# EAGLE design sense_part (EAGLE 7.2.0)
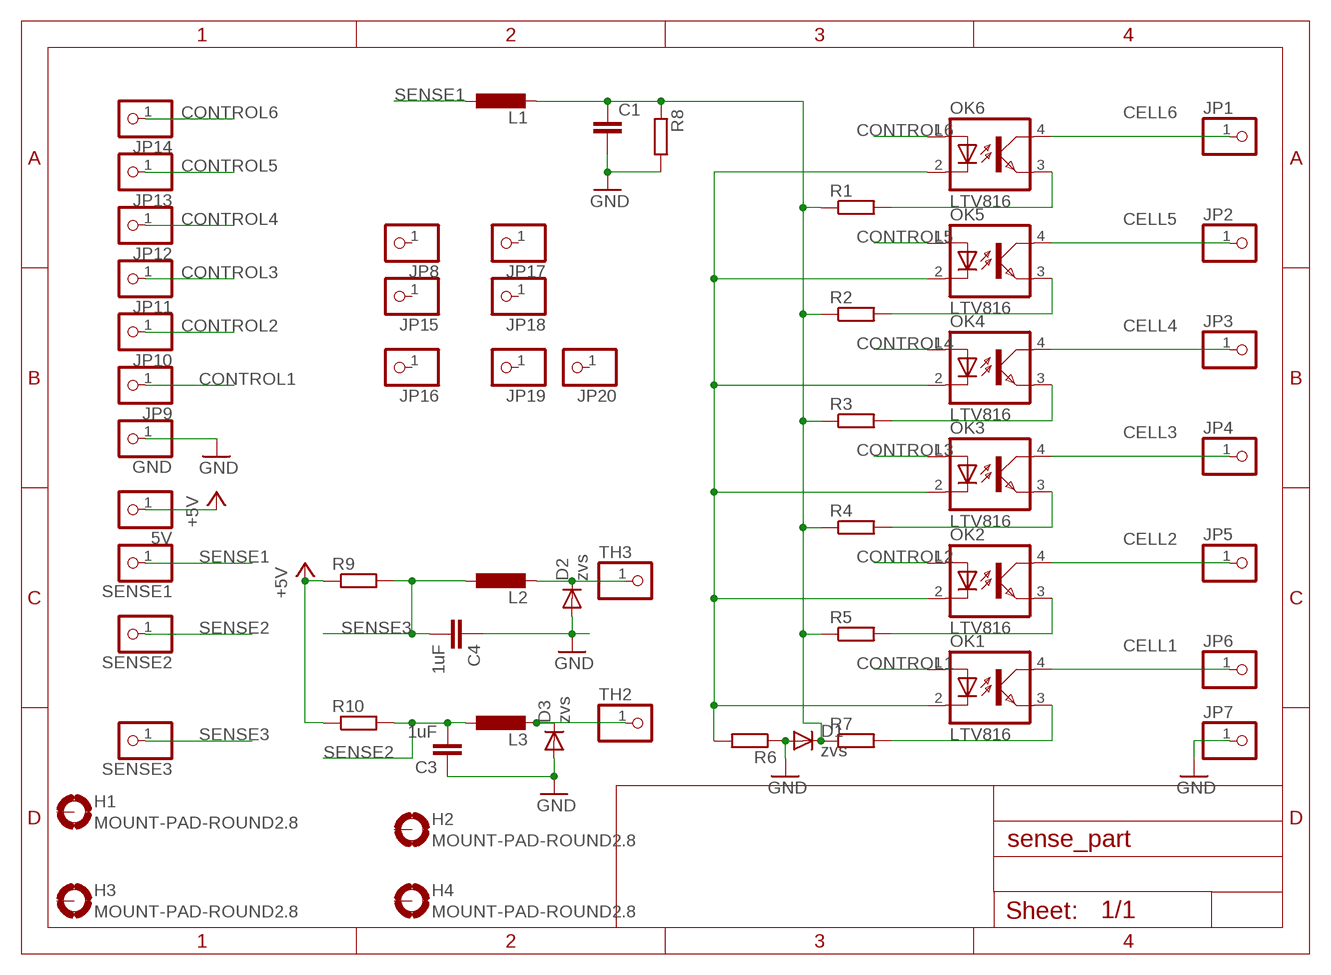
[diagram p0: schematic, sheet 1]

## Parts
5V  PINHD-1X1  [1X01]
C1  C-EU050-030X075  [C050-030X075]
C3  1uF  C-EU025-024X044  [C025-024X044]
C4  1uF  C-EU025-024X044  [C025-024X044]
D1  zvs  CGRM4001-G  [SOD-123_MINI-SMA]
D2  zvs  CGRM4001-G  [SOD-123_MINI-SMA]
D3  zvs  CGRM4001-G  [SOD-123_MINI-SMA]
GND  PINHD-1X1  [1X01]
H1  MOUNT-PAD-ROUND2.8  [2,8-PAD]
H2  MOUNT-PAD-ROUND2.8  [2,8-PAD]
H3  MOUNT-PAD-ROUND2.8  [2,8-PAD]
H4  MOUNT-PAD-ROUND2.8  [2,8-PAD]
JP1  PINHD-1X1  [1X01]
JP2  PINHD-1X1  [1X01]
JP3  PINHD-1X1  [1X01]
JP4  PINHD-1X1  [1X01]
JP5  PINHD-1X1  [1X01]
JP6  PINHD-1X1  [1X01]
JP7  PINHD-1X1  [1X01]
JP8  PINHD-1X1  [1X01]
JP9  PINHD-1X1  [1X01]
JP10  PINHD-1X1  [1X01]
JP11  PINHD-1X1  [1X01]
JP12  PINHD-1X1  [1X01]
JP13  PINHD-1X1  [1X01]
JP14  PINHD-1X1  [1X01]
JP15  PINHD-1X1  [1X01]
JP16  PINHD-1X1  [1X01]
JP17  PINHD-1X1  [1X01]
JP18  PINHD-1X1  [1X01]
JP19  PINHD-1X1  [1X01]
JP20  PINHD-1X1  [1X01]
L1  L-EU0207/12  [0207/12]
L2  L-EU0207/12  [0207/12]
L3  L-EU0207/12  [0207/12]
OK1  LTV816  [DIL04]
OK2  LTV816  [DIL04]
OK3  LTV816  [DIL04]
OK4  LTV816  [DIL04]
OK5  LTV816  [DIL04]
OK6  LTV816  [DIL04]
R1  R-EU_R1206  [R1206]
R2  R-EU_R1206  [R1206]
R3  R-EU_R1206  [R1206]
R4  R-EU_R1206  [R1206]
R5  R-EU_R1206  [R1206]
R6  R-EU_R1206  [R1206]
R7  R-EU_R1206  [R1206]
R8  R-EU_R1206  [R1206]
R9  R-EU_R1206  [R1206]
R10  R-EU_R1206  [R1206]
SENSE1  PINHD-1X1  [1X01]
SENSE2  PINHD-1X1  [1X01]
SENSE3  PINHD-1X1  [1X01]
TH2  PINHD-1X1  [1X01]
TH3  PINHD-1X1  [1X01]

## Nets
+5V: 5V.1 R9.1 R10.1
CELL1: JP6.1 OK1.4(COL)
CELL2: JP5.1 OK2.4(COL)
CELL3: JP4.1 OK3.4(COL)
CELL4: JP3.1 OK4.4(COL)
CELL5: JP2.1 OK5.4(COL)
CELL6: JP1.1 OK6.4(COL)
CONTROL1: JP9.1 OK1.1(A)
CONTROL2: JP10.1 OK2.1(A)
CONTROL3: JP11.1 OK3.1(A)
CONTROL4: JP12.1 OK4.1(A)
CONTROL5: JP13.1 OK5.1(A)
CONTROL6: JP14.1 OK6.1(A)
GND: C1.2 C3.1 C4.1 D1.A D2.A D3.A GND.1 JP7.1 R6.1 R8.2
N$1: OK1.2(C) OK2.2(C) OK3.2(C) OK4.2(C) OK5.2(C) OK6.2(C) R6.2
N$2: OK2.3(EMIT) R5.2
N$3: OK3.3(EMIT) R4.2
N$4: OK4.3(EMIT) R3.2
N$5: OK5.3(EMIT) R2.2
N$6: OK6.3(EMIT) R1.2
N$7: D3.C L3.2 TH2.1
N$8: OK1.3(EMIT) R7.2
N$9: C1.1 D1.C L1.2 R1.1 R2.1 R3.1 R4.1 R5.1 R7.1 R8.1
N$12: D2.C L2.2 TH3.1
SENSE1: L1.1 SENSE1.1
SENSE2: C3.2 L3.1 R10.2 SENSE2.1
SENSE3: C4.2 L2.1 R9.2 SENSE3.1
Unconnected: H1.B2,8(MOUNT) H2.B2,8(MOUNT) H3.B2,8(MOUNT) H4.B2,8(MOUNT) JP8.1 JP15.1 JP16.1 JP17.1 JP18.1 JP19.1 JP20.1

## Library data of the parts
5V GND JP1-JP20 SENSE1-SENSE3 TH2 TH3 = pinhead:PINHD-1X1: PIN HEADER
C1 = rcl:C-EU: CAPACITOR, European symbol
C3 C4 = resistor:C-EU: CAPACITOR, European symbol
D1-D3 = diode:CGRM400*-G: Molded plasitc,JEDEC SOD-123/Mini SMA Source: Comchip CGRM4001-G.pdf
H1-H4 = holes:MOUNT-PAD-ROUND: MOUNTING PAD, round
L1-L3 = rcl:L-EU: INDUCTOR, European symbol
OK1-OK6 = optocoupler:LTV816: OPTO COUPLER Source: LITEON, LTV816.pdf; OC_FARNELL: unknown; OC_NEWARK: unknown
R1-R10 = rcl:R-EU_: RESISTOR, European symbol

## Board
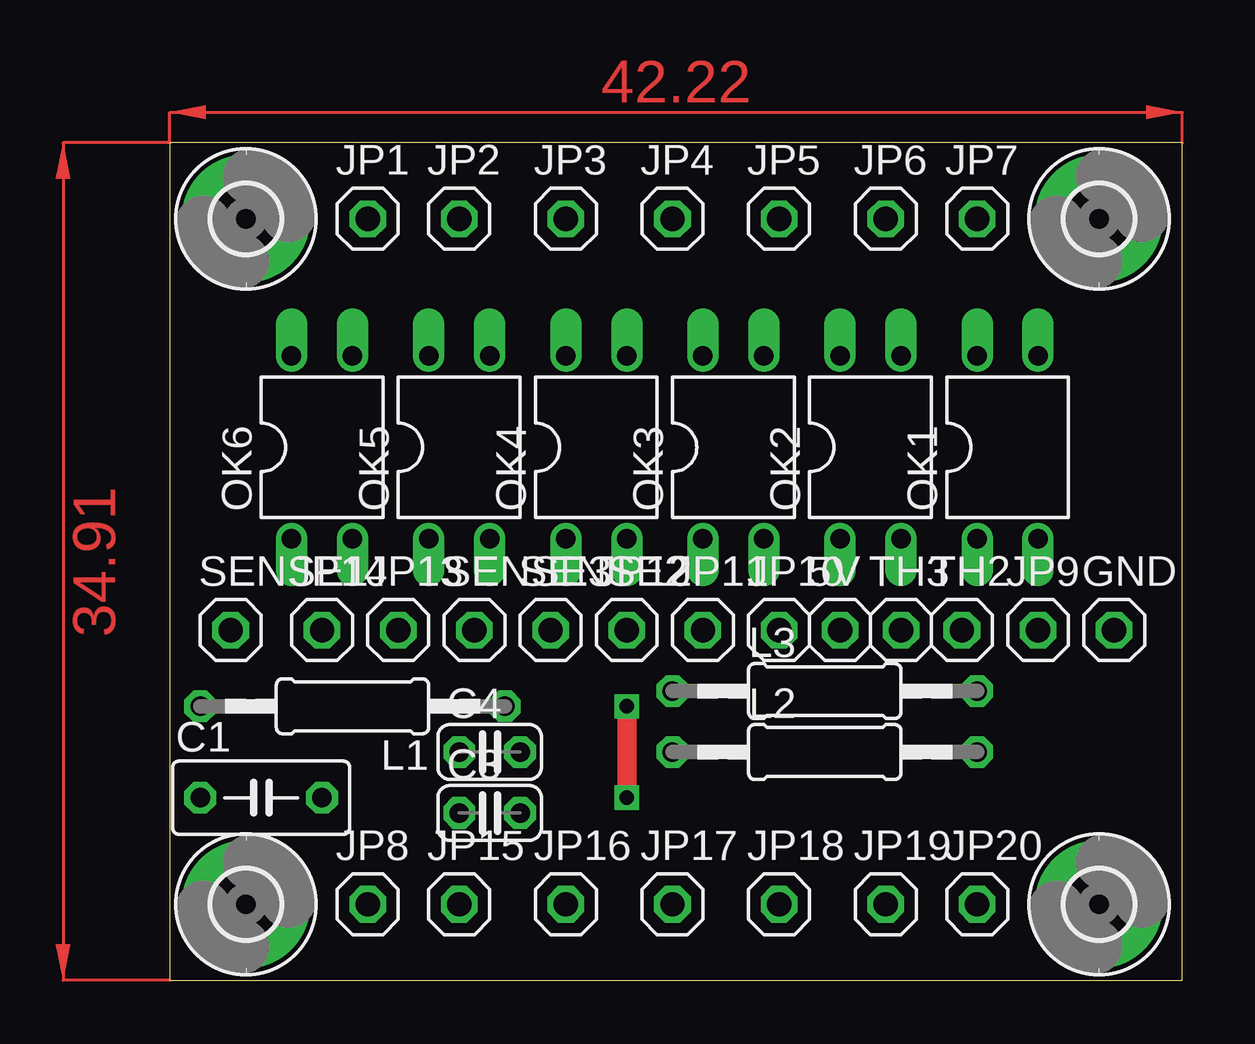
[diagram p1: board, top side]
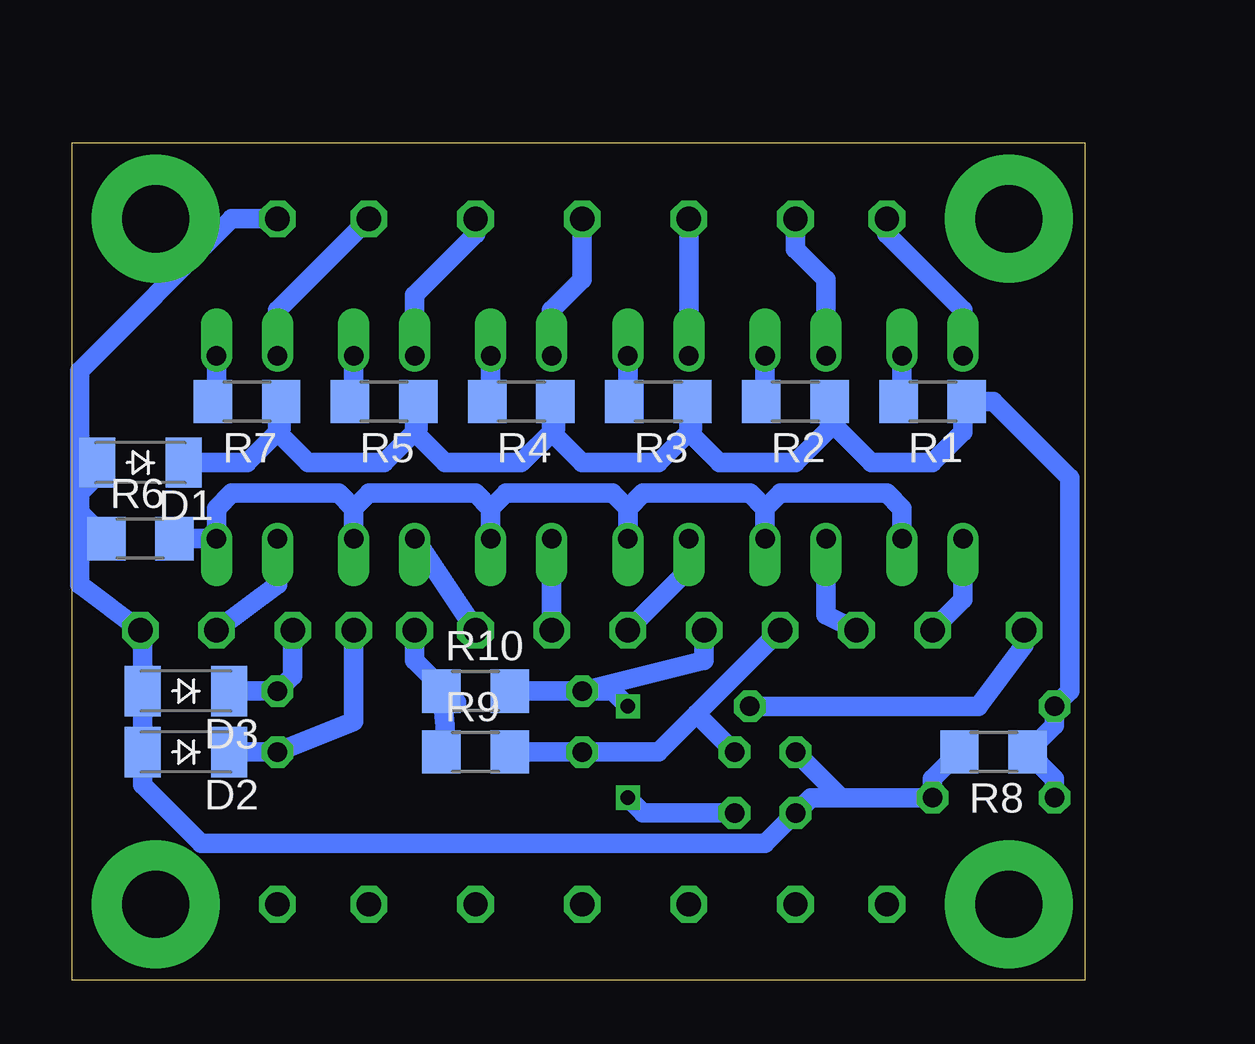
[diagram p2: board, bottom side, seen from below]

Size 42.22 x 34.91 mm. Coordinates in mm from the lower left corner, seen from the top.
Outline: 0,0 42.22,0 42.22,34.91 0,34.91 0,0
Copper layers (1*16): Top 0.035mm / dielectric 1.5mm / Bottom 0.035mm
Design rules "default": minimum track width 10mil, minimum drill 24mil, track to track 8mil, track to pad 8mil, pad to pad 8mil, via to via 8mil, smd to smd 8mil, copper to edge 40mil, drill to drill 8mil, minimum pad ring 10mil, minimum via ring 8mil, stop-mask expansion 4mil, vias tented up to drill 0mil, thermal gap 10mil

### Footprints (pad centres in the part's own frame; a part is rotated, then mirrored left to right if it is on the bottom)
1X01 = drill 1.016 octagon: 1 0,0
C050-030X075 = drill 0.813 octagon: 1 -2.54,0; 2 2.54,0
C025-024X044 = drill 0.813 octagon: 1 -1.27,0; 2 1.27,0
SOD-123_MINI-SMA = smd 1.5 x 2.1: A 1.8,0; C -1.8,0
2,8-PAD = drill 2.8 pad 5.334: B2,8 0,0
0207/12 = drill 0.813 octagon: 1 -6.35,0; 2 6.35,0
DIL04 = drill 0.813 offset: 1 -1.27,-3.81; 2 1.27,-3.81; 3 1.27,3.81; 4 -1.27,3.81
R1206 = smd 1.6 x 1.803: 1 -1.422,0; 2 1.422,0

### Placement (x,y rotation side)
5V  27.94,14.61 0 top
C1  3.81,7.62 0 top
C3  13.34,6.99 0 top
C4  13.34,9.53 0 top
D1  39.37,21.59 180 bottom
D2  37.47,9.53 180 bottom
D3  37.47,12.06 180 bottom
GND  39.37,14.61 0 top
H1  3.17,31.75 0 top
H2  3.17,3.17 0 top
H3  38.73,3.17 0 top
H4  38.73,31.75 0 top
JP1  8.26,31.75 0 top
JP2  12.06,31.75 0 top
JP3  16.51,31.75 0 top
JP4  20.95,31.75 0 top
JP5  25.4,31.75 0 top
JP6  29.84,31.75 0 top
JP7  33.66,31.75 0 top
JP8  8.26,3.17 0 top
JP9  36.2,14.61 0 top
JP10  25.4,14.61 0 top
JP11  22.23,14.61 0 top
JP12  19.05,14.61 0 top
JP13  9.53,14.61 0 top
JP14  6.35,14.61 0 top
JP15  12.06,3.17 0 top
JP16  16.51,3.17 0 top
JP17  20.95,3.17 0 top
JP18  25.4,3.17 0 top
JP19  29.84,3.17 0 top
JP20  33.66,3.17 0 top
L1  7.62,11.43 180 top
L2  27.3,9.53 0 top
L3  27.3,12.06 0 top
OK1  34.92,22.23 0 top
OK2  29.21,22.23 0 top
OK3  23.5,22.23 0 top
OK4  17.78,22.23 0 top
OK5  12.06,22.23 0 top
OK6  6.35,22.23 0 top
R1  6.35,24.13 180 bottom
R2  12.06,24.13 180 bottom
R3  17.78,24.13 180 bottom
R4  23.5,24.13 180 bottom
R5  29.21,24.13 180 bottom
R6  39.37,18.41 0 bottom
R7  34.92,24.13 180 bottom
R8  3.81,9.53 180 bottom
R9  25.4,9.53 0 bottom
R10  25.4,12.06 0 bottom
SENSE1  2.54,14.61 0 top
SENSE2  15.88,14.61 0 top
SENSE3  12.7,14.61 0 top
TH2  33.02,14.61 0 top
TH3  30.48,14.61 0 top

### Tracks (layer width: path | path; a pad name or v marks a point on that pad's centre or on a via)
+5V
  Bottom 0.813: R9.1 26.82,9.68 26.67,10.16 26.67,10.64 R10.1 26.19,11.58 27.94,13.34 5V.1
CELL1
  Bottom 0.813: JP6.1 33.66,27.94 OK1.4
CELL2
  Bottom 0.813: JP5.1 25.4,31.11 27.94,28.57 OK2.4
CELL3
  Bottom 0.813: JP4.1 20.95,29.21 22.23,27.94 OK3.4
CELL4
  Bottom 0.813: JP3.1 OK4.4
CELL5
  Bottom 0.813: JP2.1 12.06,30.48 10.79,29.21 OK5.4
CELL6
  Bottom 0.813: JP1.1 8.26,31.11 5.08,27.94 OK6.4
CONTROL1
  Bottom 0.813: OK1.1 33.66,16.51 JP9.1
CONTROL2
  Bottom 0.813: OK2.1 JP10.1
CONTROL3
  Bottom 0.813: OK3.1 JP11.1
CONTROL4
  Bottom 0.813: OK4.1 16.51,17.14 JP12.1
CONTROL5
  Bottom 0.813: OK5.1 10.79,15.24 JP13.1
CONTROL6
  Bottom 0.813: OK6.1 5.08,15.88 JP14.1
GND
  Bottom 0.813: JP7.1 35.56,31.75 41.91,25.4 41.91,20.32 | 41.91,19.53 41.91,16.51 GND.1 39.27,14.61 D3.A D2.A 39.27,8.15 36.83,5.71 13.34,5.71 C3.1 11.43,7.62 10.16,7.62 | D1.A 41.17,21.06 41.91,20.32 | 41.91,20.32 41.91,19.53 | 41.91,19.53 R6.1 | R8.2 6.35,8.41 C1.2 10.16,7.62 | 10.16,7.62 C4.1
N$1
  Bottom 0.813: OK6.2 7.62,19.68 8.26,20.32 12.7,20.32 13.34,19.68 | OK5.2 13.34,19.68 | 13.34,19.68 13.97,20.32 18.41,20.32 19.05,19.68 | OK4.2 19.05,19.68 | 19.05,19.68 19.68,20.32 24.13,20.32 24.77,19.68 | OK3.2 24.77,19.68 | 24.77,19.68 25.4,20.32 29.84,20.32 30.48,19.68 | OK2.2 30.48,19.68 | 30.48,19.68 31.11,20.32 35.56,20.32 36.2,19.68 OK1.2 R6.2
N$2
  Bottom 0.813: OK2.3 30.48,24.28 R5.2
N$3
  Bottom 0.813: OK3.3 24.77,24.28 R4.2
N$4
  Bottom 0.813: OK4.3 19.05,24.28 R3.2
N$5
  Bottom 0.813: OK5.3 13.34,24.28 R2.2
N$6
  Bottom 0.813: OK6.3 7.62,24.28 R1.2
N$7
  Bottom 0.813: D3.C L3.2 33.02,12.7 TH2.1
N$8
  Bottom 0.813: OK1.3 36.2,24.28 R7.2
N$9
  Bottom 0.813: D1.C 34.92,21.59 33.5,23.01 R7.1 33.66,23.98 33.66,22.86 32.38,21.59 29.21,21.59 27.79,23.01 R5.1 27.94,23.98 27.94,22.86 26.67,21.59 23.5,21.59 22.07,23.01 R4.1 22.23,23.98 22.23,22.86 20.95,21.59 17.78,21.59 16.36,23.01 R3.1 16.51,23.98 16.51,22.86 15.24,21.59 12.06,21.59 10.64,23.01 R2.1 10.64,23.34 8.89,21.59 6.35,21.59 5.08,22.86 5.08,23.98 R1.1 3.81,24.13 0.64,20.95 0.64,12.06 L1.2 1.27,10.64 R8.1 1.27,8.41 C1.1
N$12
  Bottom 0.813: TH3.1 30.48,10.79 L2.2 D2.C
SENSE1
  Bottom 0.813: SENSE1.1 2.54,13.97 4.45,11.43 L1.1
SENSE2  (via drill 0.6)
  Top 0.813: v19.05,11.43 v19.05,7.62
  Bottom 0.813: SENSE2.1 15.88,13.34 L3.1 | R10.2 L3.1 | L3.1 19.68,12.06 v19.05,11.43 | v19.05,7.62 18.41,6.99 C3.2
SENSE3
  Bottom 0.813: SENSE3.1 16.19,11.11 | 16.19,11.11 17.78,9.53 L2.1 R9.2 | C4.2 16.19,11.11
(copper drawn outside any net)
  shapes: Top area x2